# Altium project ADConv.PrjPCB
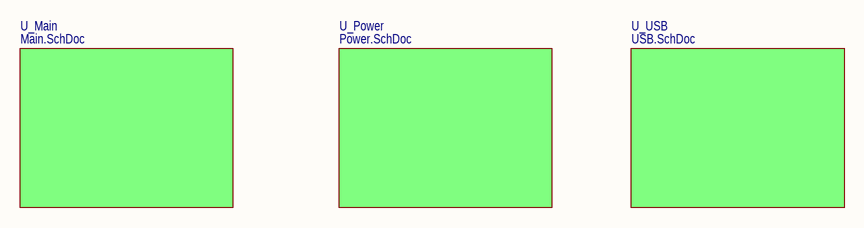
[diagram p0: TopLvl.SchDoc]
5 sheets, 115 parts. Net scope: flat (ports and power ports of the same name join across sheets).
Board file: ADConv.PcbDoc
Sheets:
  TopLvl.SchDoc
    U_Main = Main.SchDoc
      U_DiffInput = DiffInput.SchDoc
    U_Power = Power.SchDoc
    U_USB = USB.SchDoc

## Sheet TopLvl.SchDoc: Наименование
size 420 x 297 mm; ApprovedBy: Сидоров; CheckedBy: Петров; Author: Иванов; CompanyName: РГППУ; Title2str: Изделия; DecimalNumber: АБВГ.123456.001 33

### Sub-sheets
U_Main = Main.SchDoc: no entries
U_Power = Power.SchDoc: no entries
U_USB = USB.SchDoc: no entries

### Notes on the sheet
- Изм.
- Лист
- N*докум.
- Подп.
- Дата
- Лит.
- Масса
- Масштаб
- Разраб.
- Пров.
- Т.контр.
- Лиcт
- Лиcтов
- Н.контр.
- Утв.

## Sheet Main.SchDoc: Наименование
size 420 x 297 mm; ApprovedBy: Сидоров; CheckedBy: Петров; Author: Иванов; CompanyName: РГППУ; Title2str: Изделия; DecimalNumber: АБВГ.123456.001 33
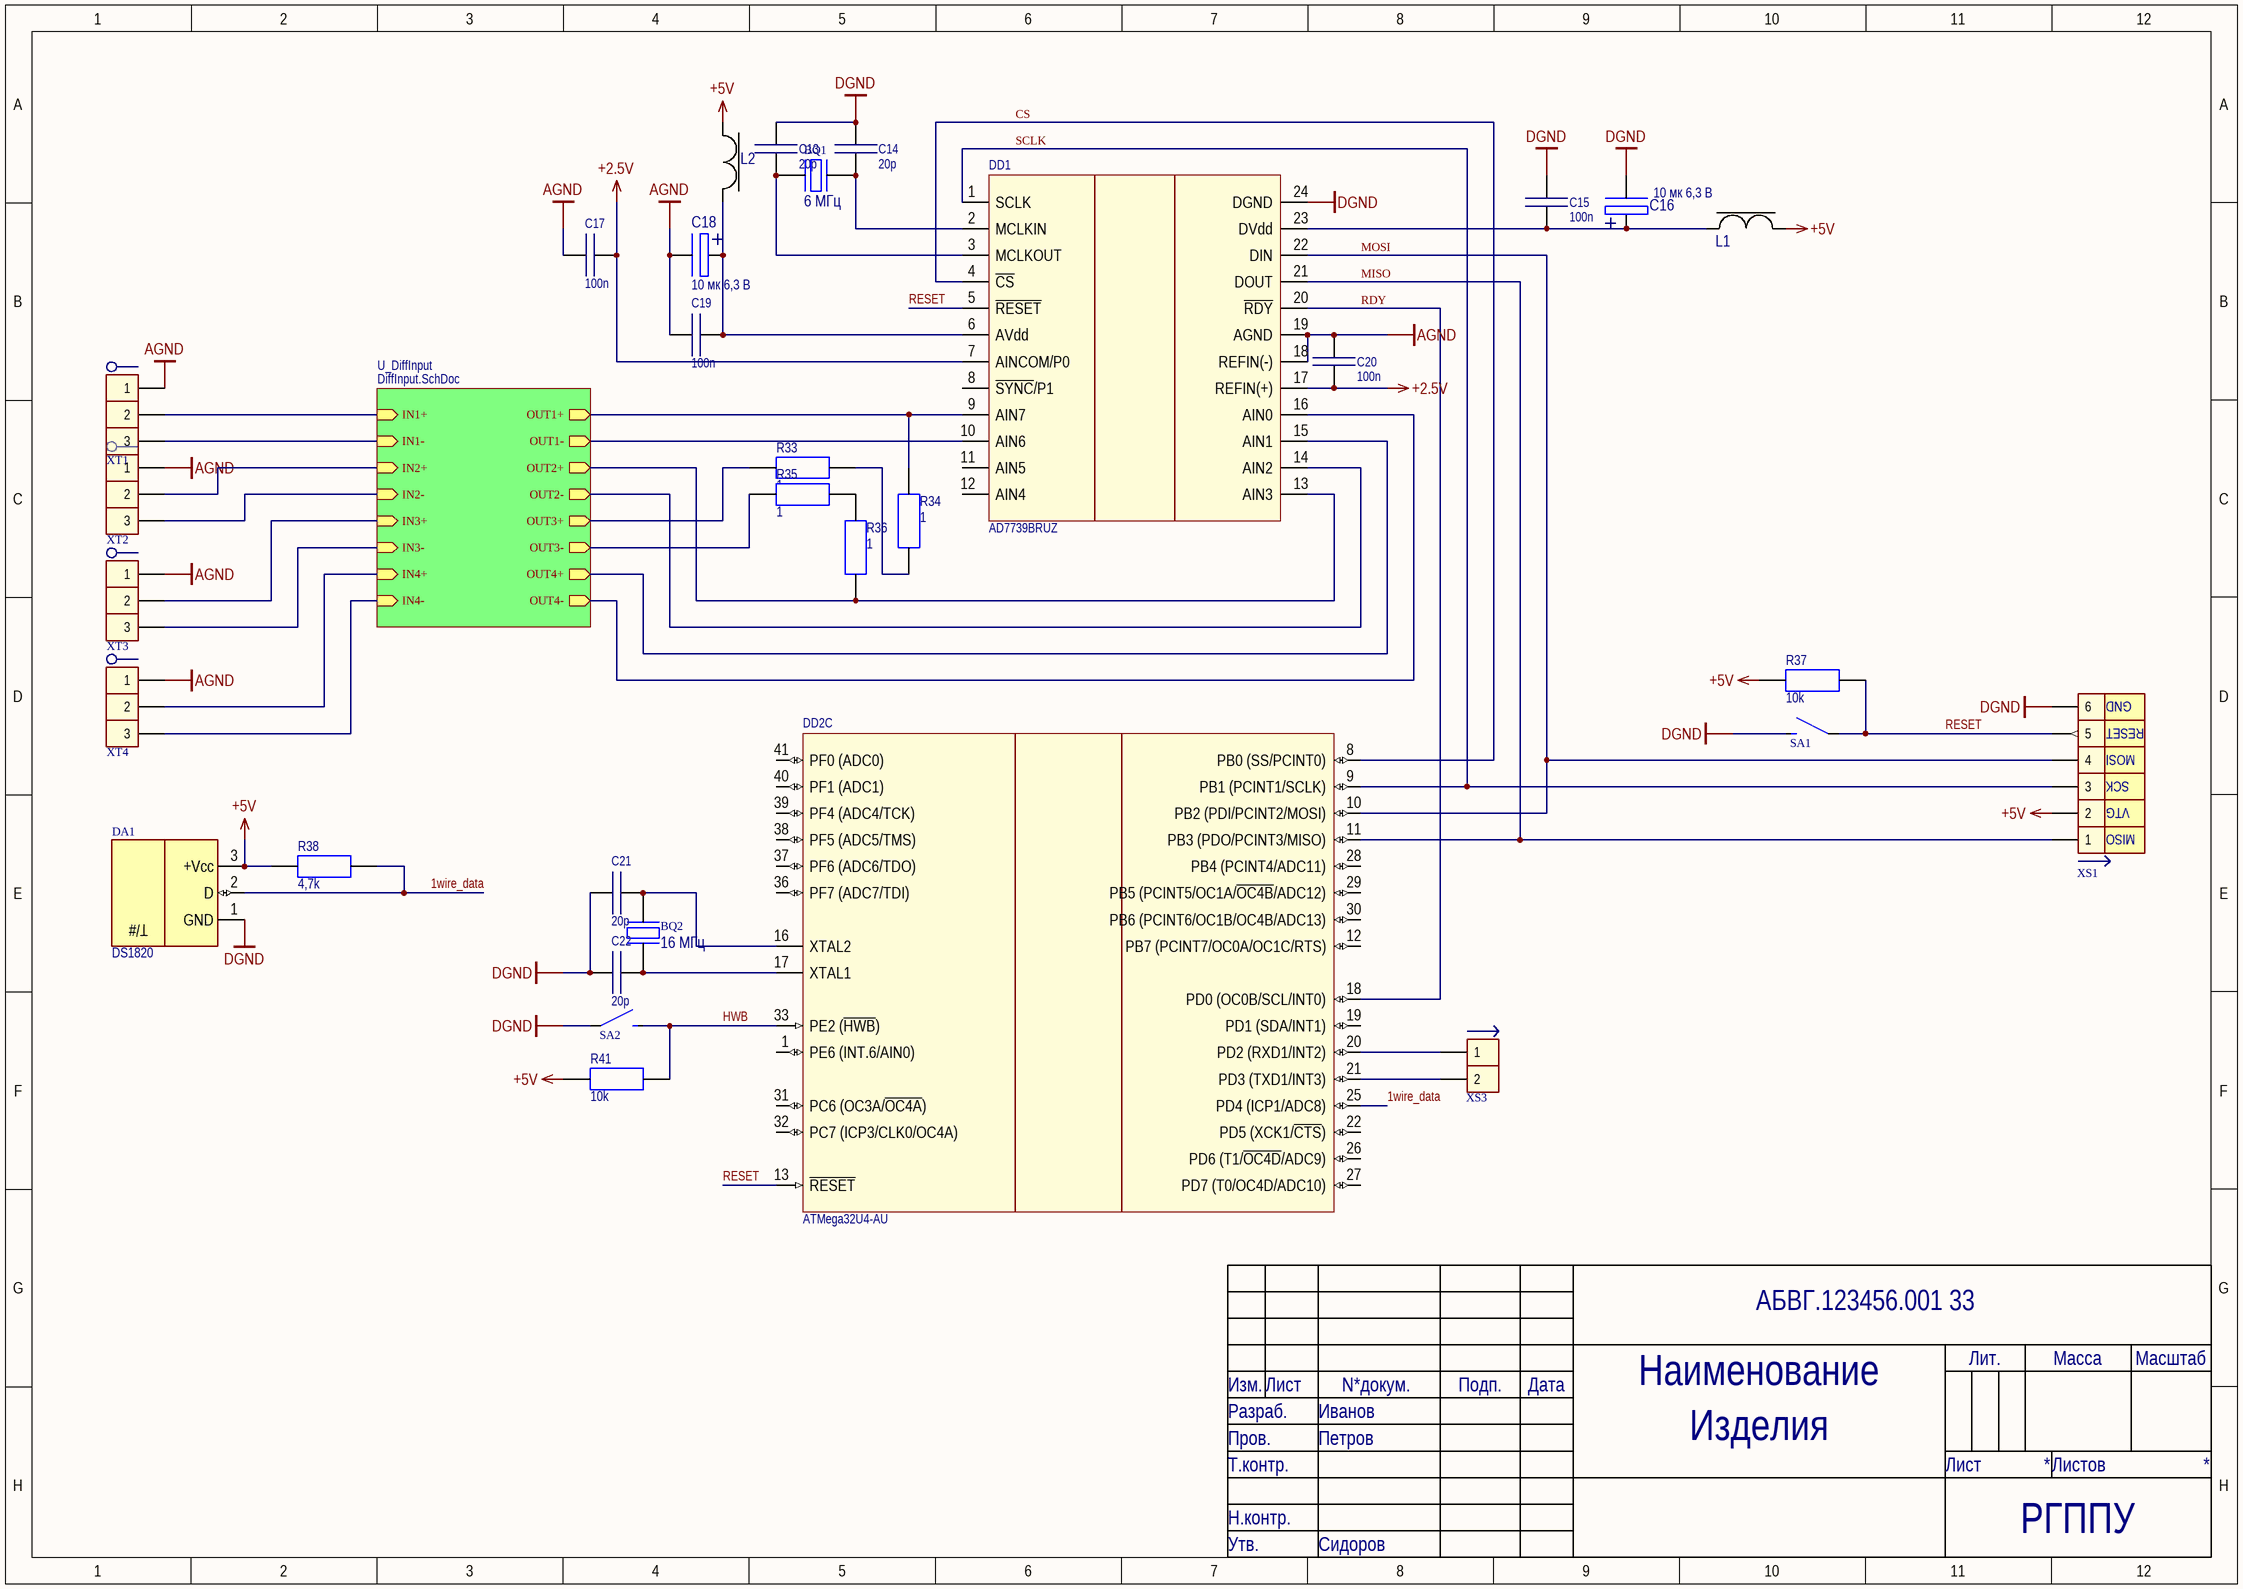
[diagram p1: Main.SchDoc]

### Parts
BQ1  6 МГц  [HC-49/S]
BQ2  16 МГц  [HC-49/S]
C13  20p  [SMDRC0805]
C14  20p  [SMDRC0805]
C15  100n  [SMDRC0805]
C16  value 10 мк 6,3 В  [К50-6]  (hidden comment: К-50-6)
C17  100n  [SMDRC0805]
C18  value 10 мк 6,3 В  [К50-6]  (hidden comment: К-50-6)
C19  100n  [SMDRC0805]
C20  100n  [SMDRC0805]
C21  20p  [SMDRC0805]
C22  20p  [SMDRC0805]
DA1  DS1820  [L78L09]
DD1  AD7739BRUZ  [TSSOP-RU-24]
DD2  ATMega32U4-AU  [44ML_L]  (part C of 3)
L1  MPZ1608S181A  [INDC0603X03M]  (value not drawn)
L2  MPZ1608S181A  [INDC0603X03M]  (value not drawn)
R33  1  [SMDRC0805]
R34  1  [SMDRC0805]
R35  1  [SMDRC0805]
R36  1  [SMDRC0805]
R37  10k  [SMDRC0805]
R38  4,7k  [SMDRC0805]
R41  10k  [SMDRC0805]
SA1  DTSM20-4.3  [DTSM20]  (value not drawn)
SA2  DTSM20-4.3  [DTSM20]  (value not drawn)
XS1  IDC-06M  [IDC-06M]  (value not drawn)
XS3  PLS-02  [PLS-02]  (value not drawn)
XT1  330-031-12  [330-031-12]  (value not drawn)
XT2  330-031-12  [330-031-12]  (value not drawn)
XT3  330-031-12  [330-031-12]  (value not drawn)
XT4  330-031-12  [330-031-12]  (value not drawn)

### Sub-sheets
U_DiffInput = DiffInput.SchDoc: IN1+ (in), IN1- (in), IN2+ (in), IN2- (in), OUT1+ (out), OUT1- (out), OUT2+ (out), OUT2- (out), IN3+ (in), IN3- (in), IN4+ (in), IN4- (in), OUT3+ (out), OUT3- (out), OUT4+ (out), OUT4- (out)

### Nets
+2.5V: C17.2 C20.1 DD1.7(AINCOM/P0) DD1.17(REFIN(+))
+5V: DA1.3(+Vcc) L1.2 L2.1 R37.2 R38.2 R41.2 XS1.2
AGND: C17.1 C18.1(-) C19.2 C20.2 DD1.18(REFIN(-)) DD1.19(AGND) XT1.1 XT2.1 XT3.1 XT4.1
DGND: C13.1 C14.1 C15.2 C16.1(-) C21.1 C22.1 DA1.1(GND) DD1.24(DGND) SA1.2 SA2.1 XS1.6
1wire_data: DA1.2(D) DD2.25(PD4_(ICP1/ADC8)) R38.1
CS: DD1.4(~{CS}) DD2.8(PB0_(SS/PCINT0))
HWB: DD2.33(PE2_(~{HWB})) R41.1 SA2.2
MISO: DD1.21(DOUT) DD2.11(PB3_(PDO/PCINT3/MISO)) XS1.1
MOSI: DD1.22(DIN) DD2.10(PB2_(PDI/PCINT2/MOSI)) XS1.4
RDY: DD1.20(~{RDY}) DD2.18(PD0_(OC0B/SCL/INT0))
RESET: DD1.5(~{RESET}) DD2.13(~{RESET}) R37.1 SA1.1 XS1.5
SCLK: DD1.1(SCLK) DD2.9(PB1_(PCINT1/SCLK)) XS1.3
NetBQ1_1: BQ1.1 C13.2 DD1.3(MCLKOUT)
NetBQ1_2: BQ1.2 C14.2 DD1.2(MCLKIN)
NetBQ2_1: BQ2.1 C22.2 DD2.17(XTAL1)
NetBQ2_2: BQ2.2 C21.2 DD2.16(XTAL2)
NetC15_1: C15.1 C16.2(+) DD1.23(DVdd) L1.1
NetC18_2: C18.2(+) C19.1 DD1.6(AVdd) L2.2
NetDD1_9: DD1.9(AIN7) R34.2 ; sheet U_DiffInput/OUT1+
NetDD1_10: DD1.10(AIN6) ; sheet U_DiffInput/OUT1-
NetDD1_13: DD1.13(AIN3) R36.1 ; sheet U_DiffInput/OUT2+
NetDD1_14: DD1.14(AIN2) ; sheet U_DiffInput/OUT2-
NetDD1_15: DD1.15(AIN1) ; sheet U_DiffInput/OUT4+
NetDD1_16: DD1.16(AIN0) ; sheet U_DiffInput/OUT4-
NetDD2_20: DD2.20(PD2_(RXD1/INT2)) XS3.1
NetDD2_21: DD2.21(PD3_(TXD1/INT3)) XS3.2
NetR33_1: R33.1 ; sheet U_DiffInput/OUT3+
NetR33_2: R33.2 R34.1
NetR35_1: R35.1 ; sheet U_DiffInput/OUT3-
NetR35_2: R35.2 R36.2
NetXT1_2: XT1.2 ; sheet U_DiffInput/IN1+
NetXT1_3: XT1.3 ; sheet U_DiffInput/IN1-
NetXT2_2: XT2.2 ; sheet U_DiffInput/IN2+
NetXT2_3: XT2.3 ; sheet U_DiffInput/IN2-
NetXT3_2: XT3.2 ; sheet U_DiffInput/IN3+
NetXT3_3: XT3.3 ; sheet U_DiffInput/IN3-
NetXT4_2: XT4.2 ; sheet U_DiffInput/IN4+
NetXT4_3: XT4.3 ; sheet U_DiffInput/IN4-

Not connected (* = marked no-connect by the designer): DD1 8(~{SYNC}/P1) 11(AIN5) 12(AIN4); DD2 1(PE6_(INT.6/AIN0)) 12(PB7_(PCINT7/OC0A/OC1C/RTS)) 19(PD1_(SDA/INT1)) 22(PD5_(XCK1/~{CTS})) 26(PD6_(T1/~{OC4D}/ADC9)) 27(PD7_(T0/OC4D/ADC10)) 28(PB4_(PCINT4/ADC11)) 29(PB5_(PCINT5/OC1A/~{OC4B}/ADC12)) 30(PB6_(PCINT6/OC1B/OC4B/ADC13)) 31(PC6_(OC3A/~{OC4A})) 32(PC7_(ICP3/CLK0/OC4A)) 36(PF7_(ADC7/TDI)) 37(PF6_(ADC6/TDO)) 38(PF5_(ADC5/TMS)) 39(PF4_(ADC4/TCK)) 40(PF1_(ADC1)) 41(PF0_(ADC0))

### Notes on the sheet
- Изм.
- Лист
- N*докум.
- Подп.
- Дата
- Лит.
- Масса
- Масштаб
- Разраб.
- Пров.
- Т.контр.
- Лиcт
- Лиcтов
- Н.контр.
- Утв.
- (in symbol Con6_M IDC-06M_SPI) GND; RESET; MOSI; SCK; VTG; MISO
- (in symbol T_DS1820) T/#

### Library data of the parts
BQ1 = Piezoelectric_6000: Piezoelectric elements; Manufacturer: Taizhou; ManufacturerPartNumber: 6000 кГц; Notes: 20ppm 20pF; ComponentLink1URL: http://www.promelec.ru/catalog_info/54/126/246/70/; ComponentLink1Description: Datasheet; Package: HC-49/S; Cost: 10; Supplier: Промэлектроника; ComponentLink2Description: Datasheet-local; Value: 6 МГц
BQ2 = Piezoelectric_16000: Piezoelectric elements; Manufacturer: Taizhou; ManufacturerPartNumber: 16000 кГц 20ppm 20pF; ComponentLink1URL: http://www.promelec.ru/catalog_info/54/126/246/70/; ComponentLink1Description: Datasheet; Package: HC-49/S; Cost: 8,54; Supplier: Промэлектроника; ComponentLink2Description: Datasheet-local; Value: 16 МГц
C13 C14 C21 C22 = Capacitor 0805 20p: Generic capasitor non-polar; PartNumber: Capacitor 0805 20p; Value: 20p; ComponentLink1Description: Datasheet; Package: 0805
C15 C17 C19 C20 = Capacitor 0805 100n: Generic capasitor non-polar; PartNumber: Capacitor 0805 100n; Value: 100n; ComponentLink1Description: Datasheet; Package: 0805
C16 C18 = 10000_006-К50: 10uF 6,3V Polar through-hole cap; ManufacturerPartNumber: К-50-6; Supplier: -; Cost: -; Package: штырьевой; ComponentLink1Description: Datasheet; ComponentLink2Description: Datasheet-local
DA1 = T_DS1820: Precision Micropower Shunt Voltage Reference; Manufacturer: Dallas Semiconductor; Package: TO-92; ComponentLink1URL: http://datasheets.maximintegrated.com/en/ds/DS18B20-PAR.pdf; ComponentLink1Description: Datasheet; ComponentLink2Description: Datasheet-local; ManufacturerPartNumber: DS1820
DD1 = AD7739: IC ADC 24BIT 8-CH 24-TSSOP; Manufacturer: Analog Devices Inc.; Number of Bits: 24; Sampling Rate (Per Second): 15.1k; Number of Inputs: 4, 8; Input Type: Differential, Single Ended; Data Interface: SPI, DSP; Configuration: MUX-ADC; Number of A/D Converters: 1; Architecture: Sigma-Delta; Reference Type: External; Voltage - Supply, Analog: 5V; Voltage - Supply, Digital: 2.7 V ~ 3.6 V, 5V; ManufacturerPartNumber: AD7739BRUZ; Supplier 1: Digi-Key; Manufacturer Part Number: AD7739BRUZ; RoHS: RoHS Compliant; Category: Integrated Circuits (ICs); Stock 1: 284; Pricing 1: 1=15.82, 62=13.93694, 124=12.2796, 558=10.92357, 1054=10.01955, 2542=9.64288, 5000=9.516 (USD); Packaging: Tube; Ratio - S/H:ADC: -; Features: True Bipolar; Operating Temperature: -40°C ~ 105°C; Package / Case: 24-TSSOP (0.173", 4.40mm Width); Supplier Device Package: 24-TSSOP; ComponentLink1URL: http://www.analog.com/media/en/technical-documentation/data-sheets/AD7739.pdf; ComponentLink1Description: http://www.analog.com/media/en/technical-documentation/data-sheets/AD7739.pdf; Supplier Part Number 1: AD7739BRUZ-ND
DD2 = ATMega32U4: ManufacturerPartNumber: ATMega32U4-AU
L1 L2 = Ferrite Bead: Value: ? мГн; ManufacturerPartNumber: MPZ1608S181A; ComponentLink1Description: Datasheet; Supplier: Промэлектроника; ComponentLink2Description: Datasheet-local; ComponentLink2URL: *
R33-R36 = Resistor 0805 1: Generic resistor; PartNumber: Resistor 0805 1; Value: 1; ComponentLink1URL: http://www.mouser.com/ds/2/447/PYu-RC0402_51_RoHS_L_6_r-8721.pdf; ComponentLink1Description: Datasheet; Package: 0805
R37 R41 = Resistor 0805 10k: Generic resistor; PartNumber: Resistor 0805 10k; Value: 10k; ComponentLink1URL: http://www.mouser.com/ds/2/447/PYu-RC0402_51_RoHS_L_6_r-8721.pdf; ComponentLink1Description: Datasheet; Package: 0805
R38 = Resistor 0805 4,7k: Generic resistor; PartNumber: Resistor 0805 4,7k; Value: 4,7k; ComponentLink1URL: http://www.mouser.com/ds/2/447/PYu-RC0402_51_RoHS_L_6_r-8721.pdf; ComponentLink1Description: Datasheet; Package: 0805
SA1 SA2 = Switch1_DTSM20-4.3: Switch open; Manufacturer: Diptronics; ManufacturerPartNumber: DTSM20-4.3; ComponentLink1Description: Datasheet; ComponentLink1URL: http://www.promelec.ru/catalog/407/1291/1323/1/70721/; ComponentLink2Description: Datasheet-local; ComponentLink2URL: *
XS1 = Con6_M IDC-06M_SPI: SPI connector; ManufacturerPartNumber: IDC-06M; ComponentLink1Description: Datasheet; ComponentLink1URL: http://www.promelec.ru/catalog/406/1218/1223/1/156430/; ComponentLink2Description: Datasheet-local; ComponentLink2URL: *
XS3 = Con2_M_PLS-02: Male 2-pin connection; ManufacturerPartNumber: PLS-02; ComponentLink1Description: Datasheet; ComponentLink1URL: http://www.promelec.ru/catalog/406/1218/1224/1/24233/; ComponentLink2Description: Datasheet-local; ComponentLink2URL: *
XT1-XT4 = Con3_D 330-031-12: Demountable connection 3-pin; Manufacturer: Degson Electronics Co., Ltd; ManufacturerPartNumber: 330-031-12; ComponentLink1Description: Datasheet; Cost: 13; Supplier: Промэлектроника; ComponentLink2Description: Datasheet-local

## Sheet DiffInput.SchDoc: Наименование
size 420 x 297 mm; ApprovedBy: Сидоров; CheckedBy: Петров; Author: Иванов; CompanyName: РГППУ; Title2str: Изделия; DecimalNumber: АБВГ.123456.001 33
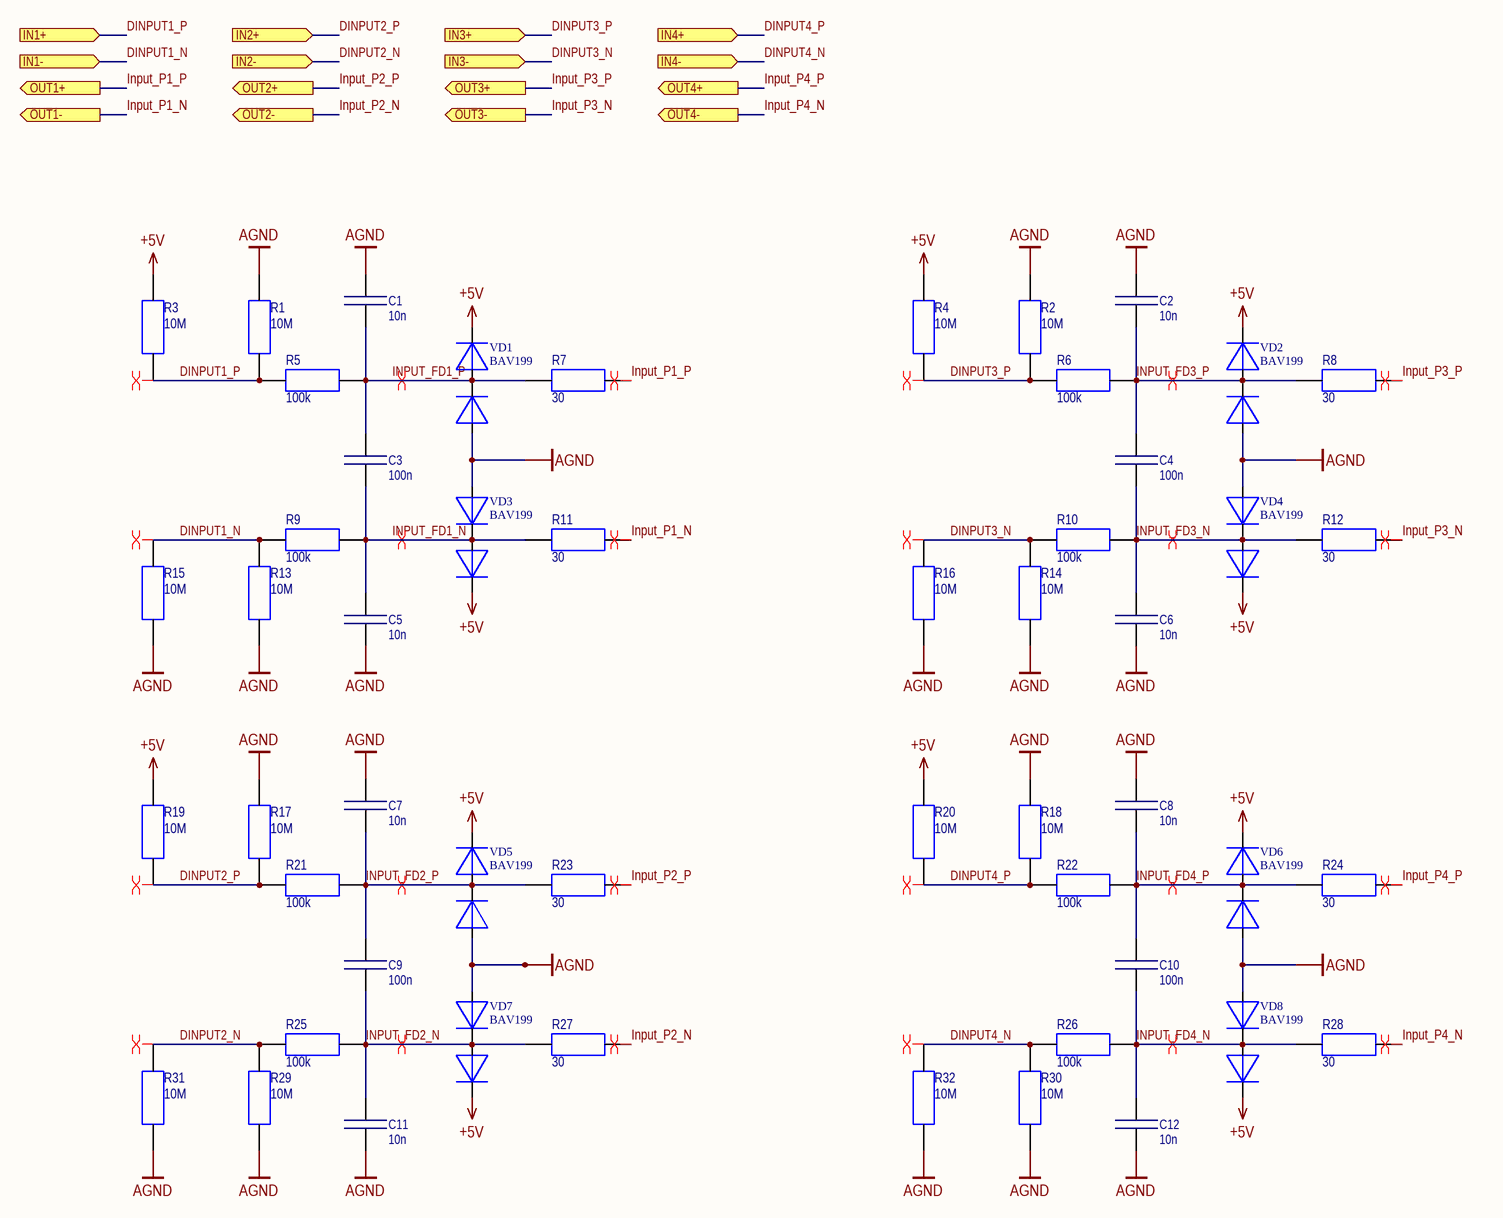
[diagram p2: DiffInput.SchDoc]

### Parts
C1  10n  [SMDRC0805]
C2  10n  [SMDRC0805]
C3  100n  [SMDRC0805]
C4  100n  [SMDRC0805]
C5  10n  [SMDRC0805]
C6  10n  [SMDRC0805]
C7  10n  [SMDRC0805]
C8  10n  [SMDRC0805]
C9  100n  [SMDRC0805]
C10  100n  [SMDRC0805]
C11  10n  [SMDRC0805]
C12  10n  [SMDRC0805]
R1  10M  [SMDRC0805]
R2  10M  [SMDRC0805]
R3  10M  [SMDRC0805]
R4  10M  [SMDRC0805]
R5  100k  [SMDRC0805]
R6  100k  [SMDRC0805]
R7  30  [SMDRC0805]
R8  30  [SMDRC0805]
R9  100k  [SMDRC0805]
R10  100k  [SMDRC0805]
R11  30  [SMDRC0805]
R12  30  [SMDRC0805]
R13  10M  [SMDRC0805]
R14  10M  [SMDRC0805]
R15  10M  [SMDRC0805]
R16  10M  [SMDRC0805]
R17  10M  [SMDRC0805]
R18  10M  [SMDRC0805]
R19  10M  [SMDRC0805]
R20  10M  [SMDRC0805]
R21  100k  [SMDRC0805]
R22  100k  [SMDRC0805]
R23  30  [SMDRC0805]
R24  30  [SMDRC0805]
R25  100k  [SMDRC0805]
R26  100k  [SMDRC0805]
R27  30  [SMDRC0805]
R28  30  [SMDRC0805]
R29  10M  [SMDRC0805]
R30  10M  [SMDRC0805]
R31  10M  [SMDRC0805]
R32  10M  [SMDRC0805]
VD1  BAV199  [SOT23 (TO-236AB)]
VD2  BAV199  [SOT23 (TO-236AB)]
VD3  BAV199  [SOT23 (TO-236AB)]
VD4  BAV199  [SOT23 (TO-236AB)]
VD5  BAV199  [SOT23 (TO-236AB)]
VD6  BAV199  [SOT23 (TO-236AB)]
VD7  BAV199  [SOT23 (TO-236AB)]
VD8  BAV199  [SOT23 (TO-236AB)]

### Ports
IN1+ (in), IN1- (in), IN2+ (in), IN2- (in), IN3+ (in), IN3- (in), IN4+ (in), IN4- (in), OUT1+ (out), OUT1- (out), OUT2+ (out), OUT2- (out), OUT3+ (out), OUT3- (out), OUT4+ (out), OUT4- (out)

### Nets
+5V: R3.2 R4.2 R19.2 R20.2 VD1.2 VD2.2 VD3.2 VD4.2 VD5.2 VD6.2 VD7.2 VD8.2
AGND: C1.2 C2.2 C5.1 C6.1 C7.2 C8.2 C11.1 C12.1 R1.2 R2.2 R13.1 R14.1 R15.1 R16.1 R17.2 R18.2 R29.1 R30.1 R31.1 R32.1 VD1.1 VD2.1 VD3.1 VD4.1 VD5.1 VD6.1 VD7.1 VD8.1
DINPUT1_N: R9.1 R13.2 R15.2 ; port IN1-
DINPUT1_P: R1.1 R3.1 R5.1 ; port IN1+
DINPUT2_N: R25.1 R29.2 R31.2 ; port IN2-
DINPUT2_P: R17.1 R19.1 R21.1 ; port IN2+
DINPUT3_N: R10.1 R14.2 R16.2 ; port IN3-
DINPUT3_P: R2.1 R4.1 R6.1 ; port IN3+
DINPUT4_N: R26.1 R30.2 R32.2 ; port IN4-
DINPUT4_P: R18.1 R20.1 R22.1 ; port IN4+
INPUT_FD1_N: C3.1 C5.2 R9.2 R11.1 VD3.3
INPUT_FD1_P: C1.1 C3.2 R5.2 R7.1 VD1.3
INPUT_FD2_N: C9.1 C11.2 R25.2 R27.1 VD7.3
INPUT_FD2_P: C7.1 C9.2 R21.2 R23.1 VD5.3
INPUT_FD3_N: C4.1 C6.2 R10.2 R12.1 VD4.3
INPUT_FD3_P: C2.1 C4.2 R6.2 R8.1 VD2.3
INPUT_FD4_N: C10.1 C12.2 R26.2 R28.1 VD8.3
INPUT_FD4_P: C8.1 C10.2 R22.2 R24.1 VD6.3
Input_P1_N: R11.2 ; port OUT1-
Input_P1_P: R7.2 ; port OUT1+
Input_P2_N: R27.2 ; port OUT2-
Input_P2_P: R23.2 ; port OUT2+
Input_P3_N: R12.2 ; port OUT3-
Input_P3_P: R8.2 ; port OUT3+
Input_P4_N: R28.2 ; port OUT4-
Input_P4_P: R24.2 ; port OUT4+

### Layout directives
differential pair: DINPUT1_N, DINPUT1_P, DINPUT2_N, DINPUT2_P, DINPUT3_N, DINPUT3_P, DINPUT4_N, DINPUT4_P, INPUT_FD1_N, INPUT_FD1_P, INPUT_FD2_N, INPUT_FD2_P, INPUT_FD3_N, INPUT_FD3_P, INPUT_FD4_N, INPUT_FD4_P, Input_P1_N, Input_P1_P, Input_P2_N, Input_P2_P, Input_P3_N, Input_P3_P, Input_P4_N, Input_P4_P

### Notes on the sheet
- Изм.
- Лист
- N*докум.
- Подп.
- Дата
- Лит.
- Масса
- Масштаб
- Разраб.
- Пров.
- Т.контр.
- Лиcт
- Лиcтов
- Н.контр.
- Утв.

### Library data of the parts
C1 C2 C5-C8 C11 C12 = Capacitor 0805 10n: Generic capasitor non-polar; PartNumber: Capacitor 0805 10n; Value: 10n; ComponentLink1Description: Datasheet; Package: 0805
C3 C4 C9 C10 = Capacitor 0805 100n: Generic capasitor non-polar; PartNumber: Capacitor 0805 100n; Value: 100n; ComponentLink1Description: Datasheet; Package: 0805
R1-R4 R13-R20 R29-R32 = Resistor 0805 10M: Generic resistor; PartNumber: Resistor 0805 10M; Value: 10M; ComponentLink1URL: http://www.mouser.com/ds/2/447/PYu-RC0402_51_RoHS_L_6_r-8721.pdf; ComponentLink1Description: Datasheet; Package: 0805
R5 R6 R9 R10 R21 R22 R25 R26 = Resistor 0805 100k: Generic resistor; PartNumber: Resistor 0805 100k; Value: 100k; ComponentLink1URL: http://www.mouser.com/ds/2/447/PYu-RC0402_51_RoHS_L_6_r-8721.pdf; ComponentLink1Description: Datasheet; Package: 0805
R7 R8 R11 R12 R23 R24 R27 R28 = Resistor 0805 30: Generic resistor; PartNumber: Resistor 0805 30; Value: 30; ComponentLink1URL: http://www.mouser.com/ds/2/447/PYu-RC0402_51_RoHS_L_6_r-8721.pdf; ComponentLink1Description: Datasheet; Package: 0805
VD1-VD8 = BAV199: Epitaxial, medium-speed switching,  double diode in a small SOT23 plastic  SMD package. The diodes are  connected in series.; Manufacturer: NXP; ManufacturerPartNumber: BAV199; Cost: 0.73; ComponentLink1Description: Datasheet; Package: SOT23; Supplier: Промэлектроника; ComponentLink1URL: http://www.nxp.com/documents/data_sheet/BAV199.pdf

## Sheet Power.SchDoc: Наименование
size 420 x 297 mm; ApprovedBy: Сидоров; CheckedBy: Петров; Author: Иванов; CompanyName: РГППУ; Title2str: Изделия; DecimalNumber: АБВГ.123456.001 33
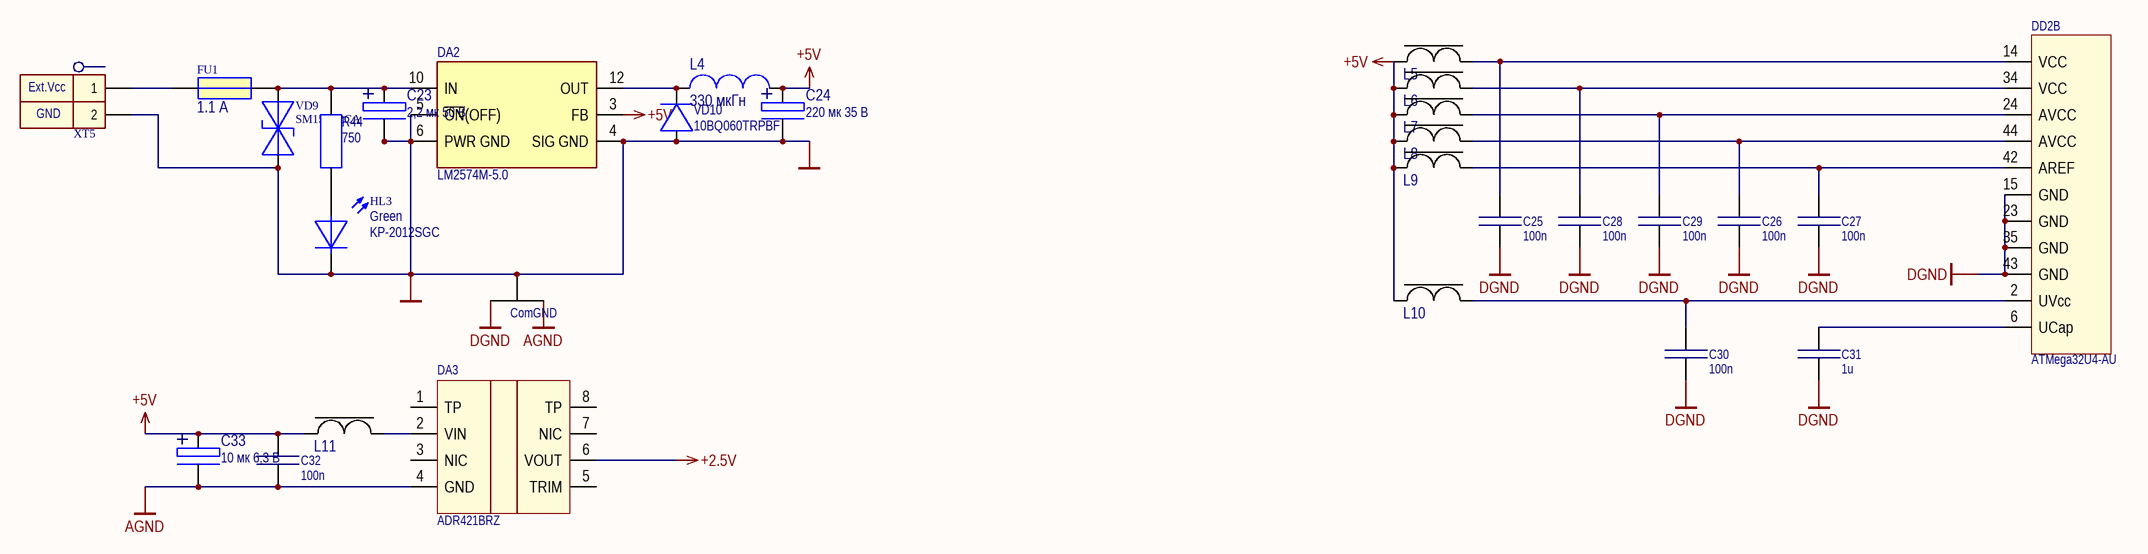
[diagram p3: Power.SchDoc]

### Parts
C23  value 2,2 мк 50 В  [CAP_POLAR_ELLYTE_B]  (hidden comment: CA050M2R20REB-0405)
C24  value 220 мк 35 В  [CAP_POLAR_ELLYTE_G]  (hidden comment: CA035M0220REG)
C25  100n  [SMDRC0805]
C26  100n  [SMDRC0805]
C27  100n  [SMDRC0805]
C28  100n  [SMDRC0805]
C29  100n  [SMDRC0805]
C30  100n  [SMDRC0805]
C31  1u  [SMDRC0805]
C32  100n  [SMDRC0805]
C33  value 10 мк 6,3 В  [К50-6]  (hidden comment: К-50-6)
DA2  LM2574M-5.0  [SOIC127P1030X264-14M]
DA3  ADR421BRZ  [SO8]
DD2  ATMega32U4-AU  [44ML_L]  (part B of 3)
FU1  value 1.1 А  [EFuse 1.1A]  (hidden comment: EFuse LP60-110F)
GND1  ComGND  [ComGND]  (net tie, no BOM)
HL3  Green  ManufacturerPartNumber: KP-2012SGC  [DIOMELF2012M]
L4  value 330 мкГн  [INDP7972X50M]  (hidden comment: SCD0705T-331K-N)
L5  MPZ1608S181A  [INDC0603X03M]  (value not drawn)
L6  MPZ1608S181A  [INDC0603X03M]  (value not drawn)
L7  MPZ1608S181A  [INDC0603X03M]  (value not drawn)
L8  MPZ1608S181A  [INDC0603X03M]  (value not drawn)
L9  MPZ1608S181A  [INDC0603X03M]  (value not drawn)
L10  MPZ1608S181A  [INDC0603X03M]  (value not drawn)
L11  MPZ1608S181A  [INDC0603X03M]  (value not drawn)
R44  750  [SMDRC0805]
VD9  SM15T12CA  [SUPRES3216X18N]
VD10  10BQ060TRPBF  [SHOTKY 4.1x3.3]
XT5  330-021-12  [330-021-12]  (value not drawn)

### Nets
+2.5V: DA3.6(VOUT)
+5V: C24.2(+) C32.2 C33.2(+) DA2.3(FB) L4.1 L5.1 L6.1 L7.1 L8.1 L9.1 L10.1 L11.2
AGND: C32.1 C33.1(-) DA3.4(GND) GND1.1
DGND: C25.2 C26.2 C27.2 C28.2 C29.2 C30.2 C31.2 DD2.15(GND) DD2.23(GND) DD2.35(GND) DD2.43(GND) GND1.3
GND: C23.1(-) C24.1(-) DA2.4(SIG_GND) DA2.5(~{ON}(OFF)) DA2.6(PWR_GND) GND1.2 HL3.2 VD9.1 VD10.A XT5.2
NetC23_2: C23.2(+) DA2.10(IN) FU1.2 R44.2 VD9.2
NetC25_1: C25.1 DD2.14(VCC) L5.2
NetC26_1: C26.1 DD2.44(AVCC) L8.2
NetC27_1: C27.1 DD2.42(AREF) L9.2
NetC28_1: C28.1 DD2.34(VCC) L6.2
NetC29_1: C29.1 DD2.24(AVCC) L7.2
NetC30_1: C30.1 DD2.2(UVcc) L10.2
NetC31_1: C31.1 DD2.6(UCap)
NetDA2_12: DA2.12(OUT) L4.2 VD10.K
NetDA3_2: DA3.2(VIN) L11.1
NetFU1_1: FU1.1 XT5.1
NetHL3_1: HL3.1 R44.1

Not connected (* = marked no-connect by the designer): DA3 1(TP) 3(NIC) 5(TRIM) 7(NIC) 8(TP)

### Notes on the sheet
- (near XT5) Ext.Vcc
- (near XT5) GND
- Изм.
- Лист
- N*докум.
- Подп.
- Дата
- Лит.
- Масса
- Масштаб
- Разраб.
- Пров.
- Т.контр.
- Лиcт
- Лиcтов
- Н.контр.
- Утв.

### Library data of the parts
C23 = 02200_050: 2,2uF 50V Polar capacitor; Manufacturer: Yageo; ManufacturerPartNumber: CA050M2R20REB-0405; Supplier: Промэлектроника; Cost: 4,11; Package: not standard; ComponentLink1Description: Datasheet; ComponentLink1URL: http://www.yageo.com/documents/recent/E-Cap_SurfaceMount_CA_2011.pdf; ComponentLink2Description: Datasheet-local; ComponentLink2URL: *
C24 = 220000_035: 220uF 35V Polar capacitor; Manufacturer: Yageo; ManufacturerPartNumber: CA035M0220REG; Supplier: Промэлектроника; Cost: 20,14; Package: not standard; ComponentLink1Description: Datasheet; ComponentLink1URL: http://www.promelec.ru/pdf/CA_2011.pdf; ComponentLink2Description: Datasheet-local; ComponentLink2URL: *
C25-C30 C32 = Capacitor 0805 100n: Generic capasitor non-polar; PartNumber: Capacitor 0805 100n; Value: 100n; ComponentLink1Description: Datasheet; Package: 0805
C31 = Capacitor 0805 1u: Generic capasitor non-polar; PartNumber: Capacitor 0805 1u; Value: 1u; ComponentLink1Description: Datasheet; Package: 0805
C33 = 10000_006-К50: 10uF 6,3V Polar through-hole cap; ManufacturerPartNumber: К-50-6; Supplier: -; Cost: -; Package: штырьевой; ComponentLink1Description: Datasheet; ComponentLink2Description: Datasheet-local
DA3 = ADR421BRZ: IC VREF SERIES 2.5V 8SOIC; Manufacturer: Analog Devices Inc.; Manufacturer Part Number: ADR421ARZ; Output Type: Fixed; Current - Output: 10mA; Tolerance: ±0.12%; Temperature Coefficient: 10ppm/°C; Noise - 0.1Hz to 10Hz: 1.75µVp-p; Voltage - Input: 4.5 V ~ 18 V; Current - Supply: 600µA; RoHS: RoHS Compliant; Category: Integrated Circuits (ICs); Packaging: Tube; Reference Type: Series; Voltage - Output (Min/Fixed): 2.5V; Voltage - Output (Max): -; Noise - 10Hz to 10kHz: -; Current - Cathode: -; Operating Temperature: -40°C ~ 125°C (TA); Mounting Type: Surface Mount; Package / Case: 8-SOIC (0.154", 3.90mm Width); Supplier Device Package: 8-SOIC; ComponentLink1URL: http://www.analog.com/media/en/technical-documentation/data-sheets/ADR420_421_423_425.pdf; ComponentLink1Description: http://www.analog.com/media/en/technical-documentation/data-sheets/ADR420_421_423_425.pdf; Supplier 1: Digi-Key; Stock 1: 2020; Pricing 1: 1=10.36, 98=8.91959, 196=7.7448, 588=6.74405, 1078=5.87385, 2548=5.6563, 5000=5.496 (USD); Supplier Part Number 1: ADR421BRZ-ND; ManufacturerPartNumber: ADR421BRZ
DD2 = ATMega32U4: ManufacturerPartNumber: ATMega32U4-AU
FU1 = EFuse LP60-110F: Fuse; ManufacturerPartNumber: EFuse LP60-110F; ComponentLink1Description: Datasheet; ComponentLink2Description: Datasheet-local; ComponentLink2URL: *
HL3 = LED1_G: Diod LED SMD Green; ComponentLink1Description: Datasheet; Cost: 2,88; ComponentLink2Description: Datasheet-local; ComponentLink2URL: *; Color: Green
L4 = SCD0705T-331K-N: Inductor; ManufacturerPartNumber: SCD0705T-331K-N; ComponentLink1Description: Datasheet; ComponentLink1URL: http://download.siliconexpert.com/pdfs/2010/12/8/6/47/4/732/yageo_/manual/inductors_smdpower_scd_2010.pdf; ComponentLink2Description: Datasheet-local; ComponentLink2URL: *
L5-L11 = Ferrite Bead: Value: ? мГн; ManufacturerPartNumber: MPZ1608S181A; ComponentLink1Description: Datasheet; Supplier: Промэлектроника; ComponentLink2Description: Datasheet-local; ComponentLink2URL: *
R44 = Resistor 0805 750: Generic resistor; PartNumber: Resistor 0805 750; Value: 750; ComponentLink1URL: http://www.mouser.com/ds/2/447/PYu-RC0402_51_RoHS_L_6_r-8721.pdf; ComponentLink1Description: Datasheet; Package: 0805
VD9 = SM15T12CA: Diod suppressor; Manufacturer: ST Microelectronics; Notes: 12 В; ComponentLink1Description: Datasheet; ComponentLink1URL: http://www.st.com/st-web-ui/static/active/en/resource/technical/document/datasheet/CD00000724.pdf; Cost: 16,73; Package: SMC/DO-214AB; Supplier: Промэлектроника; ComponentLink2Description: Datasheet-local; ComponentLink2URL: *; ManufacturerPartNumber: SM15T12CA
VD10 = 10BQ060TRPBF: DIODE SCHOTTKY 60V 1A DO214AA; Manufacturer: Vishay Semiconductor Diodes Division; Voltage - Forward (Vf) (Max) @ If: 600mV @ 1A; Current - Reverse Leakage @ Vr: 100µA @ 60V; Category: Discrete Semiconductor Products; Diode Type: Schottky; Voltage - DC Reverse (Vr) (Max): 60V; Current - Average Rectified (Io): 1A; Reverse Recovery Time (trr): -; Mounting Type: Surface Mount; Package / Case: DO-214AA, SMB; Operating Temperature - Junction: -55°C ~ 150°C; ComponentLink1URL: http://www.vishay.com/docs/94113/vs-10bq060pbf.pdf; ComponentLink1Description: http://www.vishay.com/docs/94113/vs-10bq060pbf.pdf; ManufacturerPartNumber: 10BQ060TRPBF
XT5 = Con2_D 330-021-12: Demountable connection  2-pin; Manufacturer: Degson Electronics Co., Ltd; ManufacturerPartNumber: 330-021-12; ComponentLink1Description: Datasheet; Cost: 7,45; Supplier: Промэлектроника; ComponentLink2Description: Datasheet-local
DA2 = LM2574M-5.0: ManufacturerPartNumber: LM2574M-5.0

## Sheet USB.SchDoc: Наименование
size 420 x 297 mm; ApprovedBy: Сидоров; CheckedBy: Петров; Author: Иванов; CompanyName: РГППУ; Title2str: Изделия; DecimalNumber: АБВГ.123456.001 33
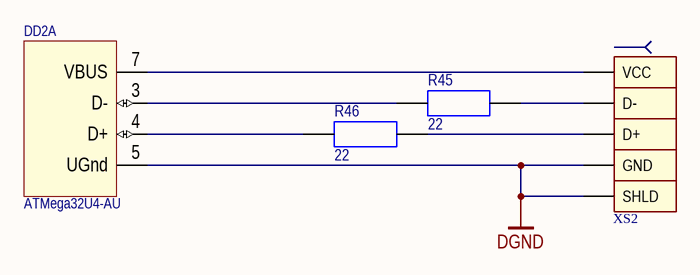
[diagram p4: USB.SchDoc]

### Parts
DD2  ATMega32U4-AU  [44ML_L]  (part A of 3)
R45  22  [SMDRC0805]
R46  22  [SMDRC0805]
XS2  USB B A-09 РОЗЕТКА НА ПЛАТУ  [USB2.0B_Vertical]  (value not drawn)

### Nets
DGND: DD2.5(UGnd) XS2.GND XS2.SHLD
NetDD2_3: DD2.3(D-) R45.1
NetDD2_4: DD2.4(D+) R46.1
NetDD2_7: DD2.7(VBUS) XS2.VCC
NetR45_2: R45.2 XS2.D-
NetR46_2: R46.2 XS2.D+

### Notes on the sheet
- Изм.
- Лист
- N*докум.
- Подп.
- Дата
- Лит.
- Масса
- Масштаб
- Разраб.
- Пров.
- Т.контр.
- Лиcт
- Лиcтов
- Н.контр.
- Утв.

### Library data of the parts
DD2 = ATMega32U4: ManufacturerPartNumber: ATMega32U4-AU
R45 R46 = Resistor 0805 22: Generic resistor; PartNumber: Resistor 0805 22; Value: 22; ComponentLink1URL: http://www.mouser.com/ds/2/447/PYu-RC0402_51_RoHS_L_6_r-8721.pdf; ComponentLink1Description: Datasheet; Package: 0805
XS2 = USB2.0-BR: USB-B Vertical; ManufacturerPartNumber: USB B A-09 РОЗЕТКА НА ПЛАТУ; ComponentLink1Description: Datasheet; ComponentLink1URL: http://www.promelec.ru/catalog/406/1229/1281/1/124861/; ComponentLink2Description: Datasheet-local; ComponentLink2URL: *

## Nets that join several sheets
+2.5V: Main (C17.2 C20.1 DD1.7 DD1.17), Power (DA3.6)
+5V: Main (7 pins), DiffInput (12 pins), Power (12 pins)
AGND: Main (10 pins), DiffInput (28 pins), Power (C32.1 C33.1 DA3.4 GND1.1)
DGND: Main (11 pins), Power (12 pins), USB (DD2.5 XS2.GND XS2.SHLD)